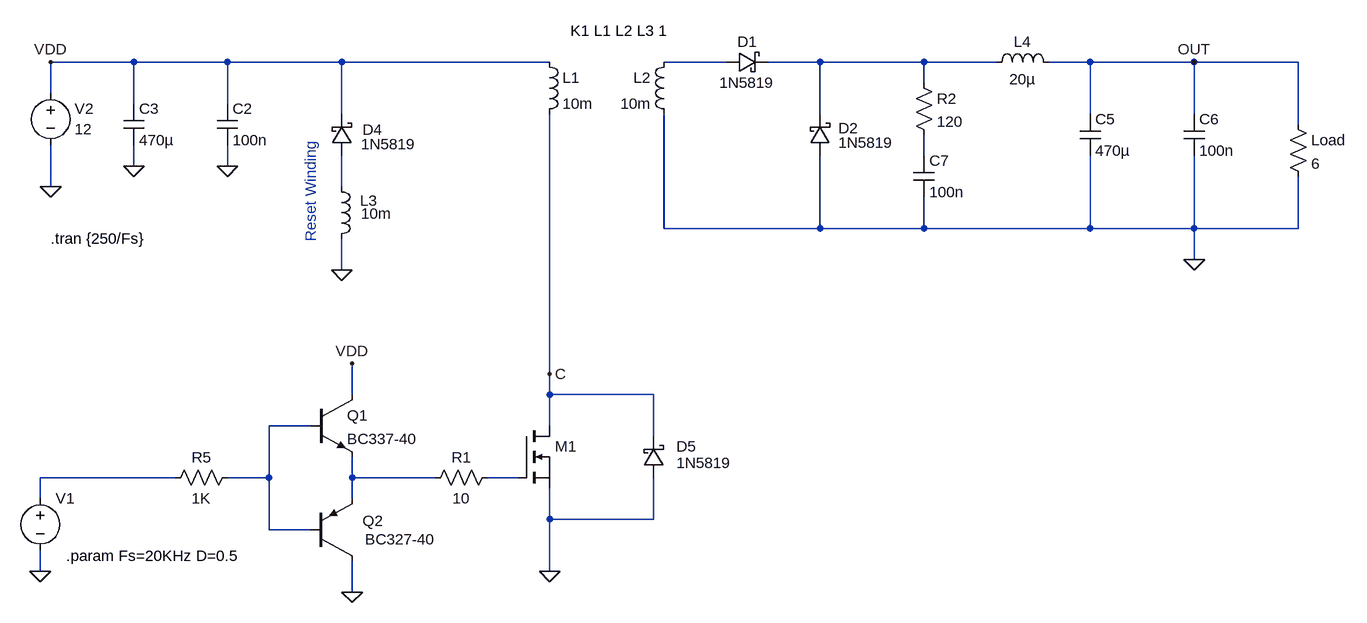
[diagram p0: schematic v1.0_ResetWinding.asc]
v1.0_ResetWinding.asc, the LTspice schematic file:
Version 4.1
SHEET 1 2076 1656
WIRE 192 96 64 96
WIRE 336 96 192 96
WIRE 512 96 336 96
WIRE 832 96 512 96
WIRE 1104 96 1008 96
WIRE 1248 96 1168 96
WIRE 1408 96 1248 96
WIRE 1520 96 1408 96
WIRE 1664 96 1600 96
WIRE 1824 96 1664 96
WIRE 1984 96 1824 96
WIRE 1408 128 1408 96
WIRE 64 144 64 96
WIRE 192 160 192 96
WIRE 336 160 336 96
WIRE 512 176 512 96
WIRE 1248 176 1248 96
WIRE 1664 176 1664 96
WIRE 1824 176 1824 96
WIRE 1984 192 1984 96
WIRE 1408 240 1408 208
WIRE 192 256 192 224
WIRE 336 256 336 224
WIRE 64 288 64 224
WIRE 512 288 512 240
WIRE 1008 352 1008 176
WIRE 1248 352 1248 240
WIRE 1248 352 1008 352
WIRE 1408 352 1408 304
WIRE 1408 352 1248 352
WIRE 1664 352 1664 240
WIRE 1664 352 1408 352
WIRE 1824 352 1824 240
WIRE 1824 352 1664 352
WIRE 1984 352 1984 272
WIRE 1984 352 1824 352
WIRE 1824 400 1824 352
WIRE 512 416 512 368
WIRE 832 576 832 176
WIRE 528 608 528 560
WIRE 832 608 832 576
WIRE 992 608 832 608
WIRE 464 656 400 656
WIRE 832 656 832 608
WIRE 992 672 992 608
WIRE 256 736 48 736
WIRE 400 736 400 656
WIRE 400 736 336 736
WIRE 528 736 528 704
WIRE 656 736 528 736
WIRE 784 736 736 736
WIRE 48 768 48 736
WIRE 528 768 528 736
WIRE 832 800 832 752
WIRE 992 800 992 736
WIRE 992 800 832 800
WIRE 400 816 400 736
WIRE 464 816 400 816
WIRE 48 880 48 848
WIRE 832 880 832 800
WIRE 528 912 528 864
FLAG 48 880 0
FLAG 64 288 0
FLAG 832 880 0
FLAG 336 256 0
FLAG 192 256 0
FLAG 64 96 VDD
FLAG 1824 96 OUT
FLAG 1824 400 0
FLAG 528 560 VDD
FLAG 528 912 0
FLAG 832 576 C
FLAG 512 416 0
SYMBOL voltage 48 752 R0
WINDOW 3 24 96 Invisible 2
WINDOW 123 0 0 Left 0
WINDOW 39 0 0 Left 0
SYMATTR Value PULSE(0 12 0 {0.01/Fs} {0.01/Fs} {D/Fs} {1/Fs})
SYMATTR InstName V1
SYMBOL res 640 752 R270
WINDOW 0 32 56 VTop 2
WINDOW 3 0 56 VBottom 2
SYMATTR InstName R1
SYMATTR Value 10
SYMBOL ind 816 80 R0
SYMATTR InstName L1
SYMATTR Value 10m
SYMATTR Type ind
SYMBOL voltage 64 128 R0
WINDOW 0 37 40 Left 2
WINDOW 3 37 71 Left 2
WINDOW 123 0 0 Left 0
WINDOW 39 0 0 Left 0
SYMATTR InstName V2
SYMATTR Value 12
SYMBOL cap 320 160 R0
SYMATTR InstName C2
SYMATTR Value 100n
SYMBOL cap 176 160 R0
SYMATTR InstName C3
SYMATTR Value 470µ
SYMBOL ind 1024 80 M0
SYMATTR InstName L2
SYMATTR Value 10m
SYMATTR Type ind
SYMBOL cap 1648 176 R0
SYMATTR InstName C5
SYMATTR Value 470µ
SYMBOL cap 1808 176 R0
SYMATTR InstName C6
SYMATTR Value 100n
SYMBOL res 1968 176 R0
SYMATTR InstName Load
SYMATTR Value 6
SYMBOL ind 1504 112 R270
WINDOW 0 32 56 VTop 2
WINDOW 3 5 56 VBottom 2
SYMATTR InstName L4
SYMATTR Value 20µ
SYMBOL res 1392 112 R0
SYMATTR InstName R2
SYMATTR Value 120
SYMBOL cap 1392 240 R0
SYMATTR InstName C7
SYMATTR Value 100n
SYMBOL nmos 784 656 R0
WINDOW 3 56 72 Invisible 2
SYMATTR Value BSC100N06LS3
SYMATTR InstName M1
SYMBOL npn 464 608 R0
SYMATTR InstName Q1
SYMATTR Value BC337-40
SYMBOL pnp 464 864 M180
WINDOW 0 80 62 Left 2
WINDOW 3 84 33 Left 2
SYMATTR InstName Q2
SYMATTR Value BC327-40
SYMBOL res 240 752 R270
WINDOW 0 32 56 VTop 2
WINDOW 3 0 56 VBottom 2
SYMATTR InstName R5
SYMATTR Value 1K
SYMBOL ind 496 384 M180
WINDOW 0 44 75 Left 2
WINDOW 3 46 55 Left 2
SYMATTR InstName L3
SYMATTR Value 10m
SYMATTR Type ind
SYMBOL schottky 1104 112 R270
WINDOW 0 32 32 VTop 2
WINDOW 3 0 32 VBottom 2
SYMATTR InstName D1
SYMATTR Value 1N5819
SYMBOL schottky 1232 240 M180
WINDOW 0 44 42 Left 2
WINDOW 3 44 20 Left 2
SYMATTR InstName D2
SYMATTR Value 1N5819
SYMBOL schottky 496 240 M180
WINDOW 0 48 40 Left 2
WINDOW 3 46 18 Left 2
SYMATTR InstName D4
SYMATTR Value 1N5819
SYMBOL schottky 976 736 M180
WINDOW 0 51 48 Left 2
WINDOW 3 51 23 Left 2
SYMATTR InstName D5
SYMATTR Value 1N5819
TEXT 88 856 Left 2 !.param Fs=20KHz D=0.5
TEXT 64 368 Left 2 !.tran {250/Fs}
TEXT 864 48 Left 2 !K1 L1 L2 L3 1
TEXT 464 216 VRight 2 ;Reset Winding

The netlist it stands for:
* v1.0_ResetWinding.asc
V1 N006 0 PULSE(0 12 0 {0.01/Fs} {0.01/Fs} {D/Fs} {1/Fs})
R1 N007 N008 10
L1 VDD C 10m
V2 VDD 0 12
C2 VDD 0 100n
C3 VDD 0 470µ
L2 N001 0 10m
C5 OUT 0 470µ
C6 OUT 0 100n
R§Load OUT 0 6
L4 N002 OUT 20µ
R2 N002 N003 120
C7 N003 0 100n
M1 C N008 0 0 BSC100N06LS3
Q1 VDD N005 N007 0 BC337-40
Q2 0 N005 N007 0 BC327-40
R5 N006 N005 1K
L3 0 N004 10m
D1 N001 N002 1N5819
D2 0 N002 1N5819
D4 N004 VDD 1N5819
D5 0 C 1N5819
.model D D
.lib standard.dio
.model NPN NPN
.model PNP PNP
.lib standard.bjt
.model NMOS NMOS
.model PMOS PMOS
.lib standard.mos
.param Fs=20KHz D=0.5
.tran {250/Fs}
K1 L1 L2 L3 1
* Reset Winding
.backanno
.end